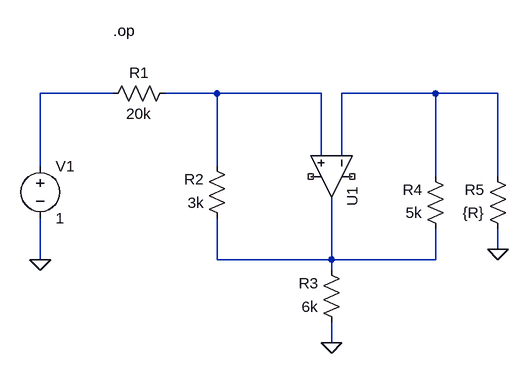
[diagram p0: schematic Q2 a1.asc]
Q2 a1.asc, the LTspice schematic file:
Version 4.1
SHEET 1 880 680
WIRE 48 16 -64 16
WIRE 208 16 128 16
WIRE 368 16 208 16
WIRE 544 16 400 16
WIRE 640 16 544 16
WIRE 368 112 368 16
WIRE 400 112 400 16
WIRE -64 128 -64 16
WIRE 208 128 208 16
WIRE 544 144 544 16
WIRE 640 144 640 16
WIRE 640 256 640 224
WIRE -64 272 -64 208
WIRE 208 272 208 208
WIRE 384 272 384 176
WIRE 384 272 208 272
WIRE 544 272 544 224
WIRE 544 272 384 272
WIRE 384 288 384 272
WIRE 384 400 384 368
FLAG -64 272 0
FLAG 640 256 0
FLAG 384 400 0
SYMBOL voltage -64 112 R0
WINDOW 123 0 0 Left 0
WINDOW 39 0 0 Left 0
SYMATTR InstName V1
SYMATTR Value 1
SYMBOL res 144 0 R90
WINDOW 0 0 56 VBottom 2
WINDOW 3 32 56 VTop 2
SYMATTR InstName R1
SYMATTR Value 20k
SYMBOL res 224 224 R180
WINDOW 0 36 76 Left 2
WINDOW 3 36 40 Left 2
SYMATTR InstName R2
SYMATTR Value 3k
SYMBOL res 400 384 R180
WINDOW 0 36 76 Left 2
WINDOW 3 36 40 Left 2
SYMATTR InstName R3
SYMATTR Value 6k
SYMBOL res 560 240 R180
WINDOW 0 36 76 Left 2
WINDOW 3 36 40 Left 2
SYMATTR InstName R4
SYMATTR Value 5k
SYMBOL res 656 240 R180
WINDOW 0 36 76 Left 2
WINDOW 3 36 40 Left 2
SYMATTR InstName R5
SYMATTR Value {R}
SYMBOL OpAmps\\UniversalOpAmp1 384 144 R90
SYMATTR InstName U1
SYMATTR Value2 Avol=1000000G GBW=1000000G Vos=0
TEXT 48 -80 Left 2 !.op

The netlist it stands for:
* Q2 a1.asc
V1 N001 0 1
R1 N002 N001 20k
R2 N004 N002 3k
R3 0 N004 6k
R4 N004 N003 5k
R5 0 N003 {R}
X§U1 N002 N003 NC_01 NC_02 N004 level1 Avol=1000000G GBW=1000000G Vos=0 En=0 Enk=0 In=0 Ink=0 Rin=500Meg  ; pins In+ In- V+ V- OUT
.op
.lib UniversalOpAmp1.lib
.backanno
.end